# EAGLE schematic main (EAGLE 9.5.1)
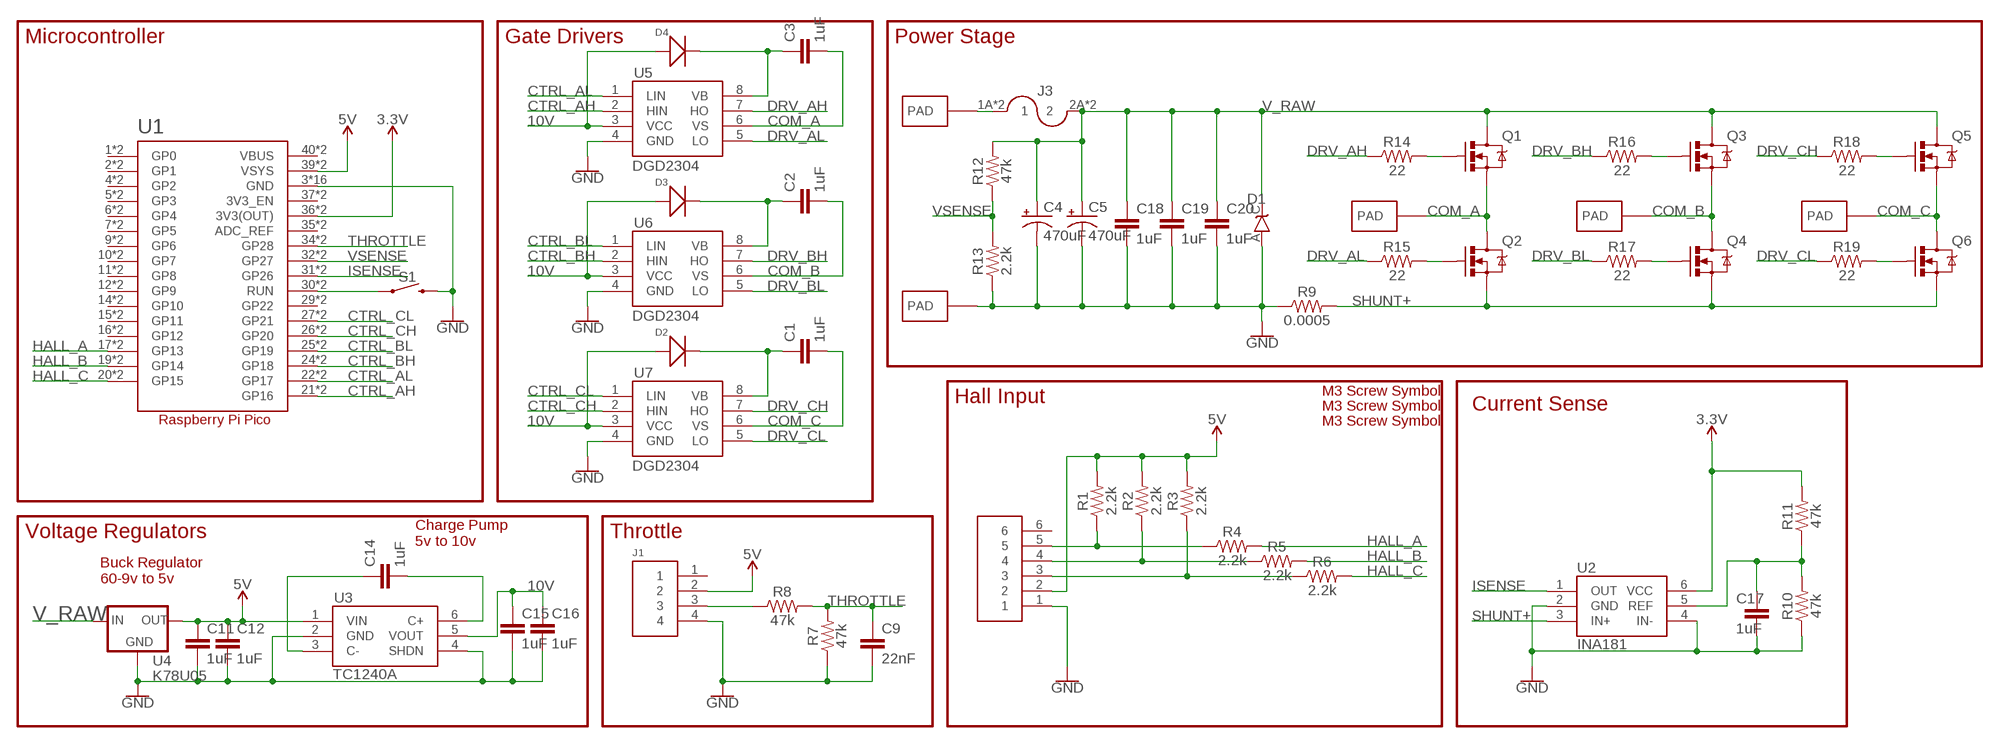
[diagram p0: schematic, sheet 1]

## Parts
C1  1uF  1.0UF-1206-50V-10%  [1206]
C2  1uF  1.0UF-1206-50V-10%  [1206]
C3  1uF  1.0UF-1206-50V-10%  [1206]
C4  470uF  1000UF-RADIAL-5MM-25V-20%  [CPOL-RADIAL-5MM-10MM]
C5  470uF  1000UF-RADIAL-5MM-25V-20%  [CPOL-RADIAL-5MM-10MM]
C9  22nF  1.0UF-1206-50V-10%  [1206]
C11  1uF  1.0UF-1206-50V-10%  [1206]
C12  1uF  1.0UF-1206-50V-10%  [1206]
C14  1uF  1.0UF-1206-50V-10%  [1206]
C15  1uF  1.0UF-1206-50V-10%  [1206]
C16  1uF  1.0UF-1206-50V-10%  [1206]
C17  1uF  1.0UF-1206-50V-10%  [1206]
C18  1uF  1.0UF-1206-50V-10%  [1206]
C19  1uF  1.0UF-1206-50V-10%  [1206]
C20  1uF  1.0UF-1206-50V-10%  [1206]
D1  TVS  TVS_UNIDO-214AC  [DO-214AC]
D2  SMD-DIODE-100V-200MA(SOD-123)  [SOD-123]
D3  SMD-DIODE-100V-200MA(SOD-123)  [SOD-123]
D4  SMD-DIODE-100V-200MA(SOD-123)  [SOD-123]
J1  HEADER4VALULOK  [4PINVALULOK]
J2  HEADER6  [6PINVALULOK]
J3  FUSE  [AUTO_FUSE]
Q1  MOSFET-NCHANNELTO-220-FLAT  [TO-220-FLAT]
Q2  MOSFET-NCHANNELTO-220-FLAT  [TO-220-FLAT]
Q3  MOSFET-NCHANNELTO-220-FLAT  [TO-220-FLAT]
Q4  MOSFET-NCHANNELTO-220-FLAT  [TO-220-FLAT]
Q5  MOSFET-NCHANNELTO-220-FLAT  [TO-220-FLAT]
Q6  MOSFET-NCHANNELTO-220-FLAT  [TO-220-FLAT]
R1  2.2k  RESISTOR1206  [1206]
R2  2.2k  RESISTOR1206  [1206]
R3  2.2k  RESISTOR1206  [1206]
R4  2.2k  RESISTOR1206  [1206]
R5  2.2k  RESISTOR1206  [1206]
R6  2.2k  RESISTOR1206  [1206]
R7  47k  RESISTOR1206  [1206]
R8  47k  RESISTOR1206  [1206]
R9  0.0005  RESISTOR  [R2512]
R10  47k  RESISTOR1206  [1206]
R11  47k  RESISTOR1206  [1206]
R12  47k  RESISTOR1206  [1206]
R13  2.2k  RESISTOR1206  [1206]
R14  22  RESISTOR1206  [1206]
R15  22  RESISTOR1206  [1206]
R16  22  RESISTOR1206  [1206]
R17  22  RESISTOR1206  [1206]
R18  22  RESISTOR1206  [1206]
R19  22  RESISTOR1206  [1206]
S1  MOMENTARY-SWITCH-SPST-PTH-6.0MM  [TACTILE_SWITCH_PTH_6.0MM]
U1  RASPBERRY_PICO-NO_DEBUG  [PICO-PKG-NO_DEBUG]
U2  INA181  [SOT23-6]
U3  TC1240A  [SOT23-6]
U4  K78U05  V_REG_78XX  [V78W_BACKWARDS]
U5  DGD2304  [SOIC8]
U6  DGD2304  [SOIC8]
U7  DGD2304  [SOIC8]
U$4  PAD  [PAD]
U$5  PAD  [PAD]
U$6  PAD  [PAD]
U$7  PAD  [PAD]
U$8  PAD  [PAD]
U$10  SCREW  [M3HOLE]
U$11  SCREW  [M3HOLE]
U$12  SCREW  [M3HOLE]

## Nets
3.3V: R11.2 U1.36(3V3(OUT)) U1.P$36(3V3(OUT)) U2.6(VCC)
5V: C11.1 C12.1 J1.2 J2.2 R1.2 R2.2 R3.2 U1.39(VSYS) U1.P$39(VSYS) U3.1(VIN) U4.OUT
10V: C15.1 C16.1 D2.+ D3.+ D4.+ U3.5(VOUT) U5.3(VCC) U6.3(VCC) U7.3(VCC)
COM_A: C3.2 Q1.3(S) Q2.2(D) Q2.PAD(D) U5.6(VS) U$6.PAD
COM_B: C2.2 Q3.3(S) Q4.2(D) Q4.PAD(D) U6.6(VS) U$7.PAD
COM_C: C1.2 Q5.3(S) Q6.2(D) Q6.PAD(D) U7.6(VS) U$8.PAD
CTRL_AH: U1.21(GP16) U1.P$21(GP16) U5.2(HIN)
CTRL_AL: U1.22(GP17) U1.P$22(GP17) U5.1(LIN)
CTRL_BH: U1.24(GP18) U1.P$24(GP18) U6.2(HIN)
CTRL_BL: U1.25(GP19) U1.P$25(GP19) U6.1(LIN)
CTRL_CH: U1.26(GP20) U1.P$26(GP20) U7.2(HIN)
CTRL_CL: U1.27(GP21) U1.P$27(GP21) U7.1(LIN)
DRV_AH: R14.1 U5.7(HO)
DRV_AL: R15.1 U5.5(LO)
DRV_BH: R16.1 U6.7(HO)
DRV_BL: R17.1 U6.5(LO)
DRV_CH: R18.1 U7.7(HO)
DRV_CL: R19.1 U7.5(LO)
GND: C4.- C5.- C9.2 C11.2 C12.2 C15.2 C16.2 C17.2 C18.2 C19.2 C20.2 D1.A J1.4 J2.1 R7.1 R9.1 R10.1 R13.1 S1.3 U1.3(GND) U1.8(GND) U1.13(GND) U1.18(GND) U1.23(GND) U1.28(GND) U1.33(GND) U1.38(GND) U1.P$3(GND) U1.P$8(GND) U1.P$13(GND) U1.P$18(GND) U1.P$23(GND) U1.P$28(GND) U1.P$33(GND) U1.P$38(GND) U2.2(GND) U2.4(IN-) U3.2(GND) U3.4(SHDN) U4.GND U5.4(GND) U6.4(GND) U7.4(GND) U$5.PAD
HALL_A: R4.2 U1.17(GP13) U1.P$17(GP13)
HALL_B: R5.2 U1.19(GP14) U1.P$19(GP14)
HALL_C: R6.2 U1.20(GP15) U1.P$20(GP15)
ISENSE: U1.31(GP26) U1.P$31(GP26) U2.1(OUT)
N$1: C2.1 D3.- U6.8(VB)
N$2: J2.3 R3.1 R6.1
N$3: C3.1 D4.- U5.8(VB)
N$4: J2.4 R2.1 R5.1
N$5: Q1.1(G) R14.2
N$6: J2.5 R1.1 R4.1
N$7: J1.3 R8.1
N$8: C1.1 D2.- U7.8(VB)
N$9: S1.1 U1.30(RUN) U1.P$30(RUN)
N$10: C17.1 R10.2 R11.1 U2.5(REF)
N$11: Q2.1(G) R15.2
N$13: Q3.1(G) R16.2
N$14: Q4.1(G) R17.2
N$15: Q5.1(G) R18.2
N$16: Q6.1(G) R19.2
N$18: C14.1 U3.3(C-)
N$19: C14.2 U3.6(C+)
SHUNT+: Q2.3(S) Q4.3(S) Q6.3(S) R9.2 U2.3(IN+)
THROTTLE: C9.1 R7.2 R8.2 U1.34(GP28) U1.P$34(GP28)
V_PREFUSE: J3.1A J3.1B U$4.PAD
V_RAW: C4.+ C5.+ C18.1 C19.1 C20.1 D1.C J3.2A J3.2B Q1.2(D) Q1.PAD(D) Q3.2(D) Q3.PAD(D) Q5.2(D) Q5.PAD(D) R12.2 U4.IN
VSENSE: R12.1 R13.2 U1.32(GP27) U1.P$32(GP27)
Unconnected: J1.1 J2.6 U1.1(GP0) U1.2(GP1) U1.4(GP2) U1.5(GP3) U1.6(GP4) U1.7(GP5) U1.9(GP6) U1.10(GP7) U1.11(GP8) U1.12(GP9) U1.14(GP10) U1.15(GP11) U1.16(GP12) U1.29(GP22) U1.35(ADC_REF) U1.37(3V3_EN) U1.P$1(GP0) U1.P$2(GP1) U1.P$4(GP2) U1.P$5(GP3) U1.P$6(GP4) U1.P$7(GP5) U1.P$9(GP6) U1.P$10(GP7) U1.P$11(GP8) U1.P$12(GP9) U1.P$14(GP10) U1.P$15(GP11) U1.P$16(GP12) U1.P$29(GP22) U1.P$35(ADC_REF) U1.P$37(3V3_EN)

## Notes on the sheet
- Microcontroller | Gate Drivers | Power Stage
- Hall Input
- Current Sense
- Voltage Regulators | Throttle
- Charge Pump
  5v to 10v
- Buck Regulator
  60-9v to 5v

## Power pins joined to a net without a drawn wire
VBUS: U1.40(VBUS) U1.P$40(VBUS)

## Library data of the parts
C1-C3 C9 C11 C12 C14-C20 = SparkFun-Capacitors:1.0UF: 1µF ceramic capacitors A capacitor is a passive two-terminal electrical component used to store electrical energy temporarily in an electric field.; PROD_ID: CAP-09822; VALUE: 1.0uF
C4 C5 = SparkFun-Capacitors:1000UF: 1,000µF/1mF ceramic capacitors A capacitor is a passive two-terminal electrical component used to store electrical energy temporarily in an electric field. CAP-08070; PROD_ID: CAP-09538; VALUE: 1mF
D1 = 2018:TVS_UNI
D2-D4 = Seeed-Diode:SMD-DIODE-100V-200MA(SOD-123): 304010007; MPN: MMSD4148; VALUE: MMSD4148-sod123
J1 = Custom_old:HEADER4
J2 = Custom_old:HEADER6
J3 = Custom_old:FUSE
Q1-Q6 = Custom_old:MOSFET-NCHANNEL: Generic NMOS footprint
R1-R8 R10-R19 = SparkFun-Resistors:RESISTOR: Generic Resistor Package
R9 = Custom_old:RESISTOR
S1 = SparkFun-Switches:MOMENTARY-SWITCH-SPST: Momentary Switch (Pushbutton) - SPST Normally-open (NO) SPST momentary switches (buttons, pushbuttons). Variants PTH-12MM - 12mm square, through-hole Momentary Pushbutton Switch - 12mm Square <https://www.sparkfun.com/products/9190> (COM-09190) PTH-6.0MM, PTH-6.0MM-KIT - 6.0mm square, through-hole Mini Pushbutton Switch <https://www.sparkfun.com/products/97> (COM-00097) KIT package intended for soldering kit's - only one side of pads' copper is exposed. PTH-RIGHT-ANGLE-KIT - Right-angle, through-hole Right Angle Tactile Button <https://www.sparkfun.com/products/10791> - Used on SparkFun BigTime Watch Kit <https://www.sparkfun.com/products/11734> SMD-12MM - 12mm square, surface-mount Tactile Button - SMD (12mm) <https://www.sparkfun.com/products/12993> (COM-12993) Used on SparkFun PicoBoard <https://www.sparkfun.com/products/11888> SMD-4.5MM - 4.5mm Square Trackball Switch Used on SparkFun Blackberry Trackballer Breakout <https://www.sparkfun.com/products/13169> SMD-4.6MMX2.8MM - 4.60mm x 2.80mm, surface mount Used on SparkFun SAMD21 Mini Breakout <https://www.sparkfun.com/products/13664> SMD-5.2MM, SMD-5.2-REDUNDANT - 5.2mm square, surface-mount Mini Pushbutton Switch - SMD <https://www.sparkfun.com/products/8720> (COM-08720) Used on Arduino Pro Mini <https://www.sparkfun.com/products/11114> REDUNDANT package connects both switch circuits together SMD-6.0X3.5MM - 6.0 x 3.5mm, surface mount Momentary Reset Switch SMD <https://www.sparkfun.com/products/8229> (COM-08229) SMD-6.2MM-TALL - 6.2mm square, surface mount Tactile Button - SMD (6mm) <https://www.sparkfun.com/products/12992> Used on SparkFun Digital Sandbox <https://www.sparkfun.com/products/12651> SMD-RIGHT-ANGLE - Right-angle, surface mount Used on SparkFun Block for Intel® Edison - Arduino <https://www.sparkfun.com/products/13036>; PROD_ID: SWCH-08441; SF_SKU: COM-00097
U1 = RpiPico:RASPBERRY_PICO-NO_DEBUG
U2 = Custom_old:INA181
U3 = Custom_old:TC1240A
U4 = 2018:V_REG_78XX: Voltage Regulator Standard 7805 5V regulator. IGO (Input Ground Output). Spark Fun Electronics SKU : COM-00107
U5-U7 = Custom_old:DGD2304
U$4-U$8 = Custom_old:PAD
U$10-U$12 = Custom_old:SCREW